# EAGLE design touch-exp (EAGLE 4.16)
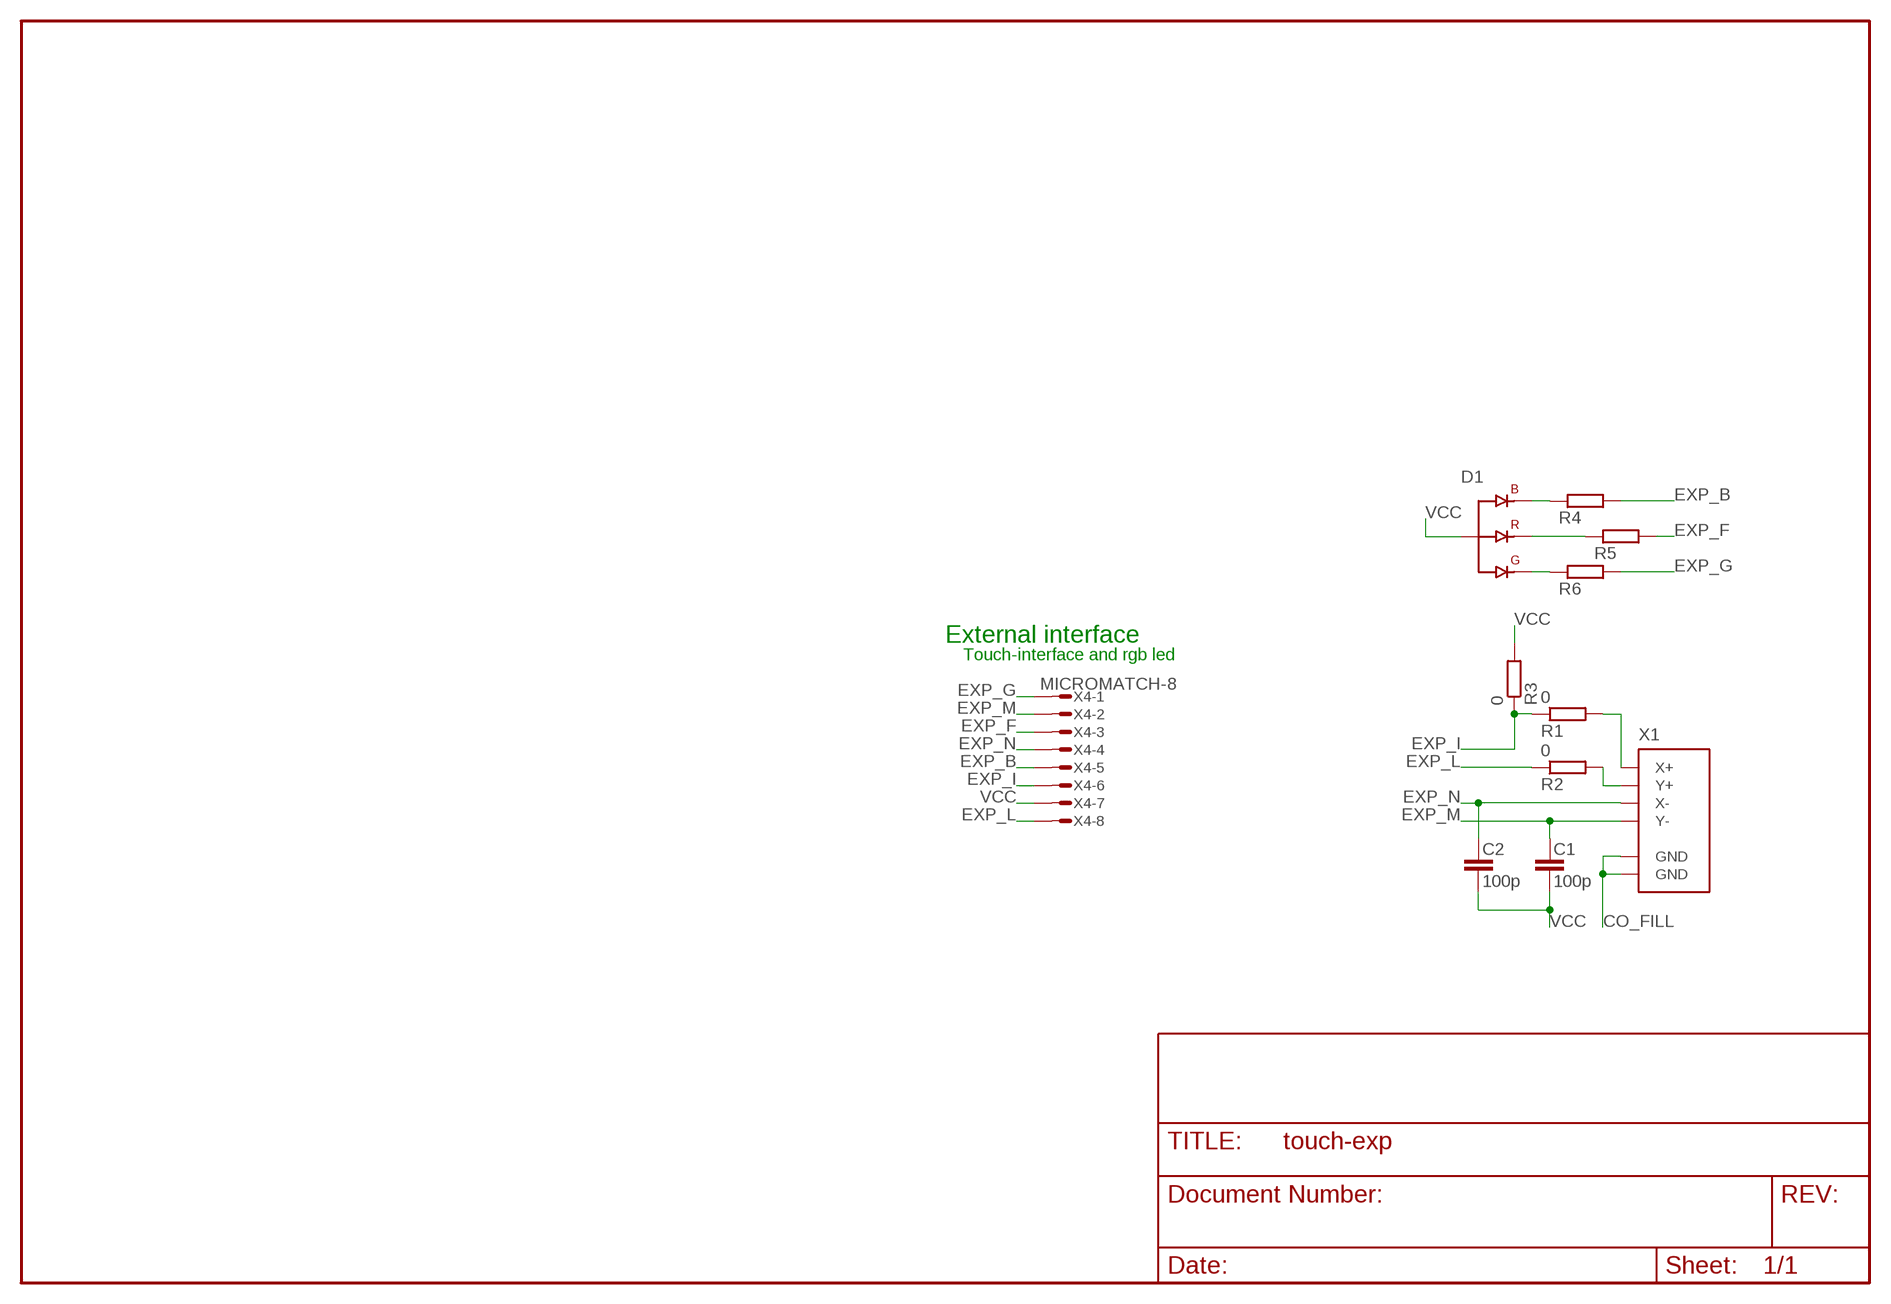
[diagram p0: schematic, sheet 1]

## Parts
C1  100p  C-EUC0603  [C0603]
C2  100p  C-EUC0603  [C0603]
D1  HSMF-C113  [HSMF-C133]
R1  0  R-EUR0603  [R0603]
R2  0  R-EUR0603  [R0603]
R3  0  R-EUR0603  [R0603]
R4  R-EUR0603  [R0603]
R5  R-EUR0603  [R0603]
R6  R-EUR0603  [R0603]
X1  ZIF-XF2U-4SMD  [SMD-4]
X4  MICROMATCH-8  [MICROMATCH-8]

## Nets
B_C: D1.P$1(B_C) R4.1
CO_FILL: X1.CLIP0(GND) X1.CLIP1(GND)
EXP_B: R4.2 X4.5
EXP_F: R5.2 X4.3
EXP_G: R6.2 X4.1
EXP_I: R1.1 R3.1 X4.6
EXP_L: R2.1 X4.8
EXP_M: C1.1 X1.3(Y-) X4.2
EXP_N: C2.1 X1.4(X-) X4.4
G_C: D1.P$4(G_C) R6.1
N$1: R2.2 X1.1(Y+)
N$4: R1.2 X1.2(X+)
R_C: D1.P$3(R_C) R5.1
VCC: C1.2 C2.2 D1.P$2(A) R3.2 X4.7

## Notes on the sheet
- External interface
- Touch-interface and rgb led

## Library data of the parts
C1 C2 = rcl:C-EU
D1 = avago-HSMF-C113:HSMF-C113
R1-R6 = rcl:R-EU
X1 = zif-xf2u:ZIF-XF2U-4
X4 = con-amp-micromatch:MICROMATCH-8: MicroMaTch 8 7-215464-8 / 0-215464-8 Drawing Number C-215464 DDEController.pdf

## Board
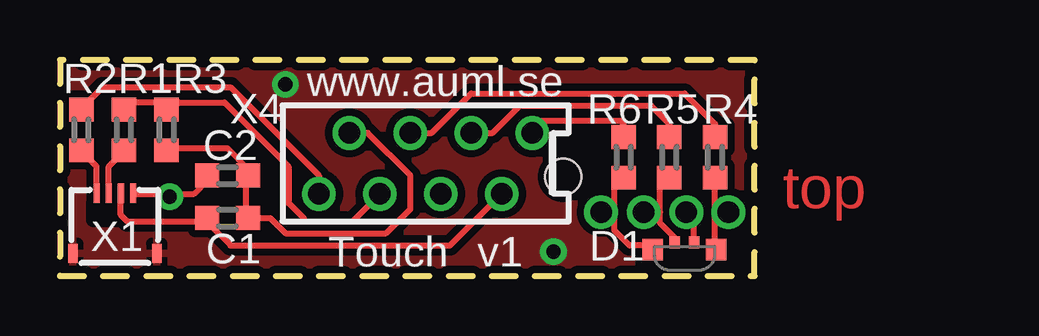
[diagram p1: board, top side]
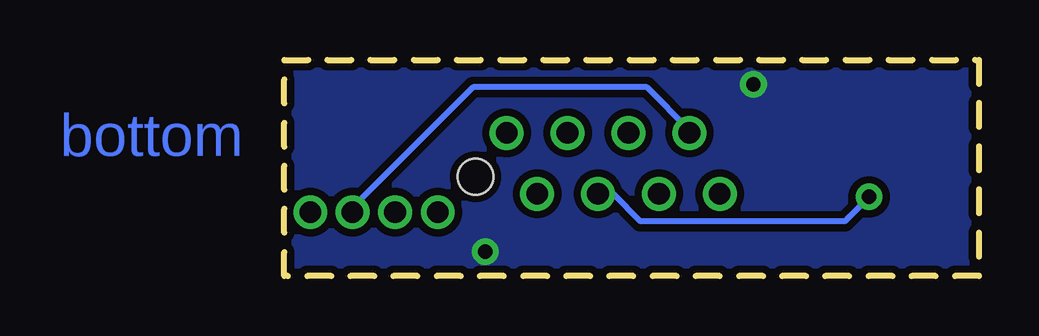
[diagram p2: board, bottom side, seen from below]

Size 28.96 x 9.02 mm. Coordinates in mm from the lower left corner, seen from the top.
Outline: 0,0 28.96,0 28.96,9.02 0,9.02 0,0
Copper layers (1*16): Top 0.035mm / dielectric 1.5mm / Bottom 0.035mm
Design rules "default": minimum track width 10mil, minimum drill 0.6mm, track to track 10mil, track to pad 10mil, pad to pad 10mil, via to via 10mil, smd to smd 8mil, copper to edge 10mil, drill to drill 8mil, minimum pad ring 10mil, minimum via ring 10mil, stop-mask expansion 4mil, vias tented up to drill 0mil, thermal gap 10mil

### Footprints (pad centres in the part's own frame; a part is rotated, then mirrored left to right if it is on the bottom)
C0603 = smd 1 x 1: 1 -0.85,0; 2 0.85,0
HSMF-C133 = smd 0.85 x 0.9: P$1 -1.325,0.05; P$4 1.325,0.05 | smd 0.43 x 0.5: P$2 -0.405,-0.25; P$3 0.405,-0.25
R0603 = smd 0.991 x 1.016: 1 -0.85,0; 2 0.85,0
SMD-4 = smd 0.254 x 0.8: 1 -0.762,0.406; 2 -0.254,0.406; 3 0.254,0.406; 4 0.762,0.406 | smd 0.4 x 0.8: CLIP0 -1.75,-2.1; CLIP1 1.75,-2.1
MICROMATCH-8 = drill 0.9 round: 1 4.445,1.27; 2 3.175,-1.27; 3 1.905,1.27; 4 0.635,-1.27; 5 -0.635,1.27; 6 -1.905,-1.27; 7 -3.175,1.27; 8 -4.445,-1.27 | hole 1.5: 5.739,-0.562

### Placement (x,y rotation side)
C1  6.99,2.41 0 top
C2  6.99,4.19 0 top
D1  26.04,1.14 180 top
R1  2.67,6.1 270 top
R2  0.89,6.1 270 top
R3  4.45,6.1 270 top
R4  27.3,4.95 90 top
R5  25.4,4.95 90 top
R6  23.5,4.95 90 top
X1  2.29,3.05 0 top
X4  15.24,4.7 0 top

### Tracks (layer width: path | path; a pad name or v marks a point on that pad's centre or on a via)
B_C  (via drill 0.9)
  Top 0.254: D1.P$1 27.36,1.22 27.3,1.4 27.3,2.67 | 27.3,2.67 R4.1 | 27.3,2.67 v27.86,2.67
CO_FILL  (via drill 0.6)
  other vias: 9.4,8 20.57,1.02
  pour Bottom (isolate 0.305, rank 3): 0,9.02 28.96,9.02 28.96,0.13 0,0.13
  pour Top (isolate 0.305, rank 3): 0,9.02 28.96,9.02 28.96,0.13 0,0.13
EXP_B
  Top 0.254: X4.5 15.49,5.97 17.14,7.62 26.04,7.62 27.3,6.35 R4.2
EXP_F
  Top 0.254: X4.3 18.03,5.97 19.18,7.11 24.64,7.11 25.4,6.35 R5.2
EXP_G
  Top 0.254: X4.1 19.68,6.22 19.94,6.48 23.37,6.48 23.5,6.35 R6.2
EXP_I
  Top 0.254: R1.1 2.79,7.24 4.45,7.24 R3.1 | R3.1 4.45,6.98 | R3.1 4.7,6.98 4.95,7.24 6.86,7.24 9.53,4.57 9.53,3.05 10.16,2.41 10.16,2.29 12.19,2.29 X4.6
EXP_L
  Top 0.254: R2.1 0.89,6.98 1.78,7.87 7.11,7.87 10.79,4.19 X4.8
EXP_M
  Top 0.254: X1.3 2.54,2.54 2.79,2.29 6.1,2.29 6.13,2.33 C1.1 6.22,2.33 6.22,2.16 7.11,1.27 16.26,1.27 X4.2
EXP_N  (via drill 0.6)
  Top 0.254: X1.4 3.05,3.43 4.32,3.43 | 4.32,3.43 v4.57,3.3 | 4.32,3.43 5.59,3.43 6.13,3.98 C2.1
  Bottom 0.254: X4.4 15.24,3.43 14.1,2.29 5.59,2.29 v4.57,3.3
G_C  (via drill 0.9)
  Top 0.254: D1.P$4 24.56,1.22 24.51,1.27 23.75,1.27 23.11,1.91 23.11,2.67 | R6.1 23.5,4.06 23.11,3.68 23.11,2.67 | 23.11,2.67 v22.55,2.67
N$1
  Top 0.254: R2.2 0.89,5.21 1.52,4.57 X1.1
N$4
  Top 0.254: R1.2 2.71,5.25 2.03,4.57 X1.2
R_C  (via drill 0.9)
  Top 0.254: D1.P$3 25.63,1.5 25.65,1.52 25.65,1.57 25.02,2.21 25.02,2.67 | R5.1 25.4,4.06 25.65,3.81 25.15,3.81 25.02,3.68 25.02,2.67 | 25.02,2.67 v24.33,2.67
VCC  (via drill 0.9)
  Top 0.254: X4.7 12.83,5.97 14.61,4.19 14.61,2.79 13.59,1.78 9.4,1.78 8.76,2.41 C1.2 7.87,2.41 7.75,2.54 7.75,4.06 7.83,4.15 C2.2 7.83,4.41 7.87,4.44 6.99,5.33 4.7,5.33 4.61,5.25 R3.2 | v26.11,2.67 26.42,2.41 26.42,1.4 26.42,1.39 D1.P$2
  Bottom 0.254: v26.11,2.67 26.16,2.79 21.08,7.87 13.84,7.87 12.06,6.1 X4.7

### Text on the board
Top: top
Bottom: bottom
tPlace: www.auml.se | Touch | v1
tStop: top
bStop: bottom